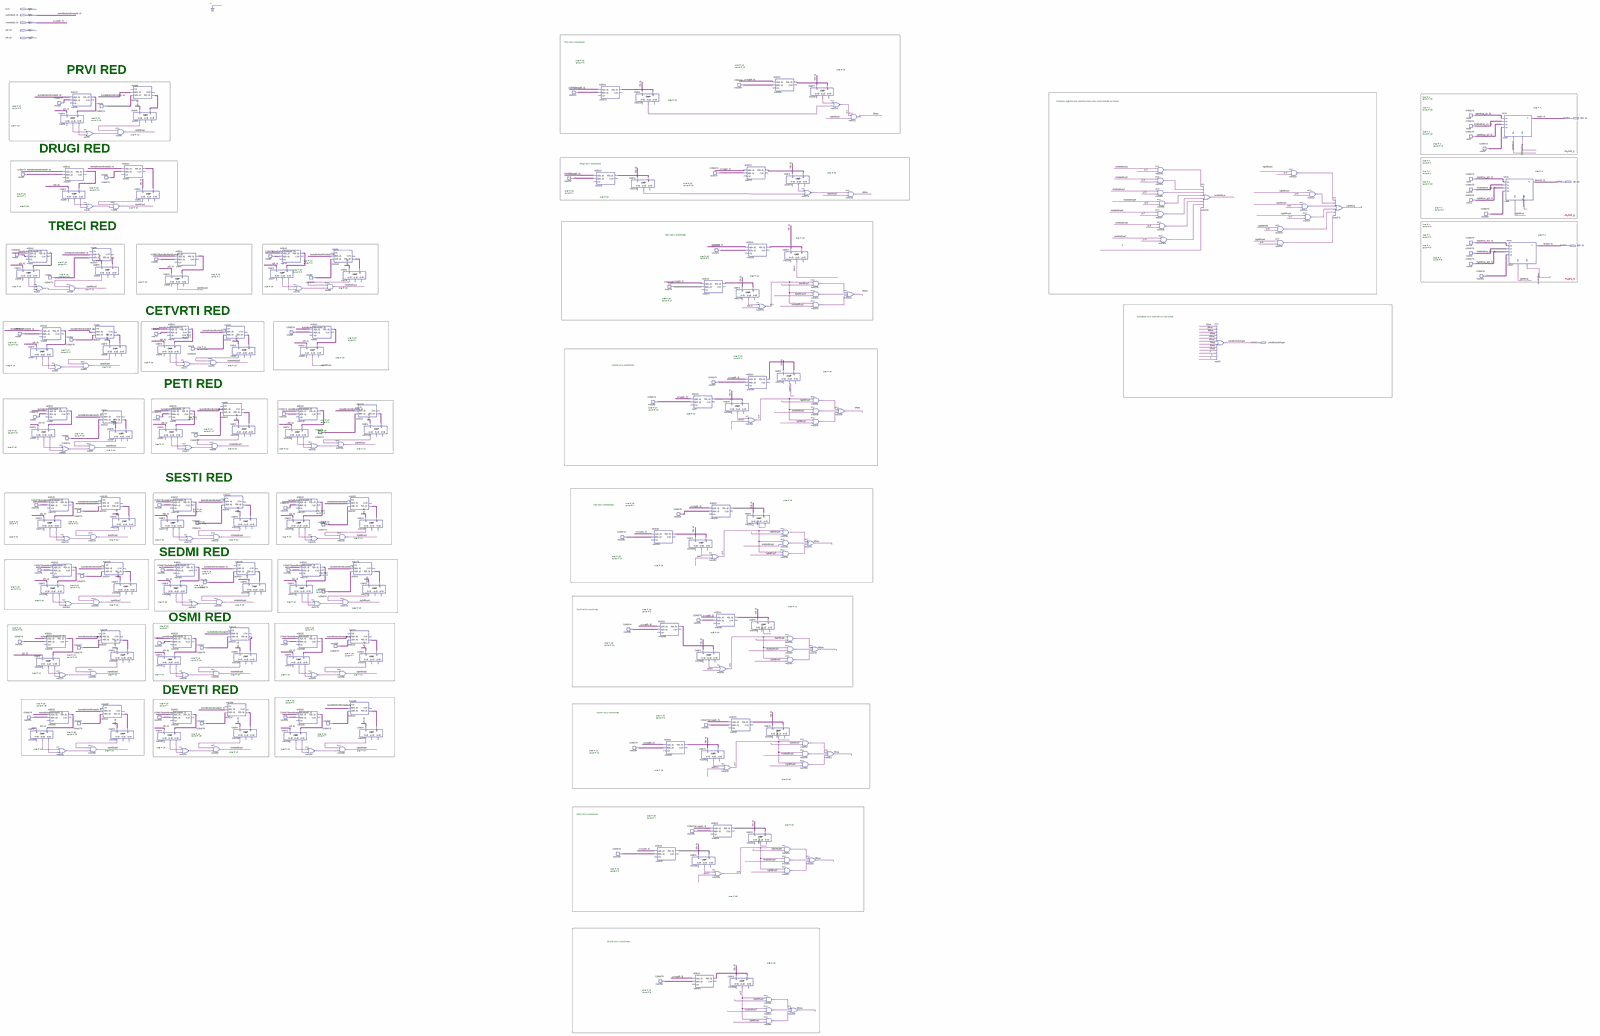
[diagram p0: schematic sheet, whole]
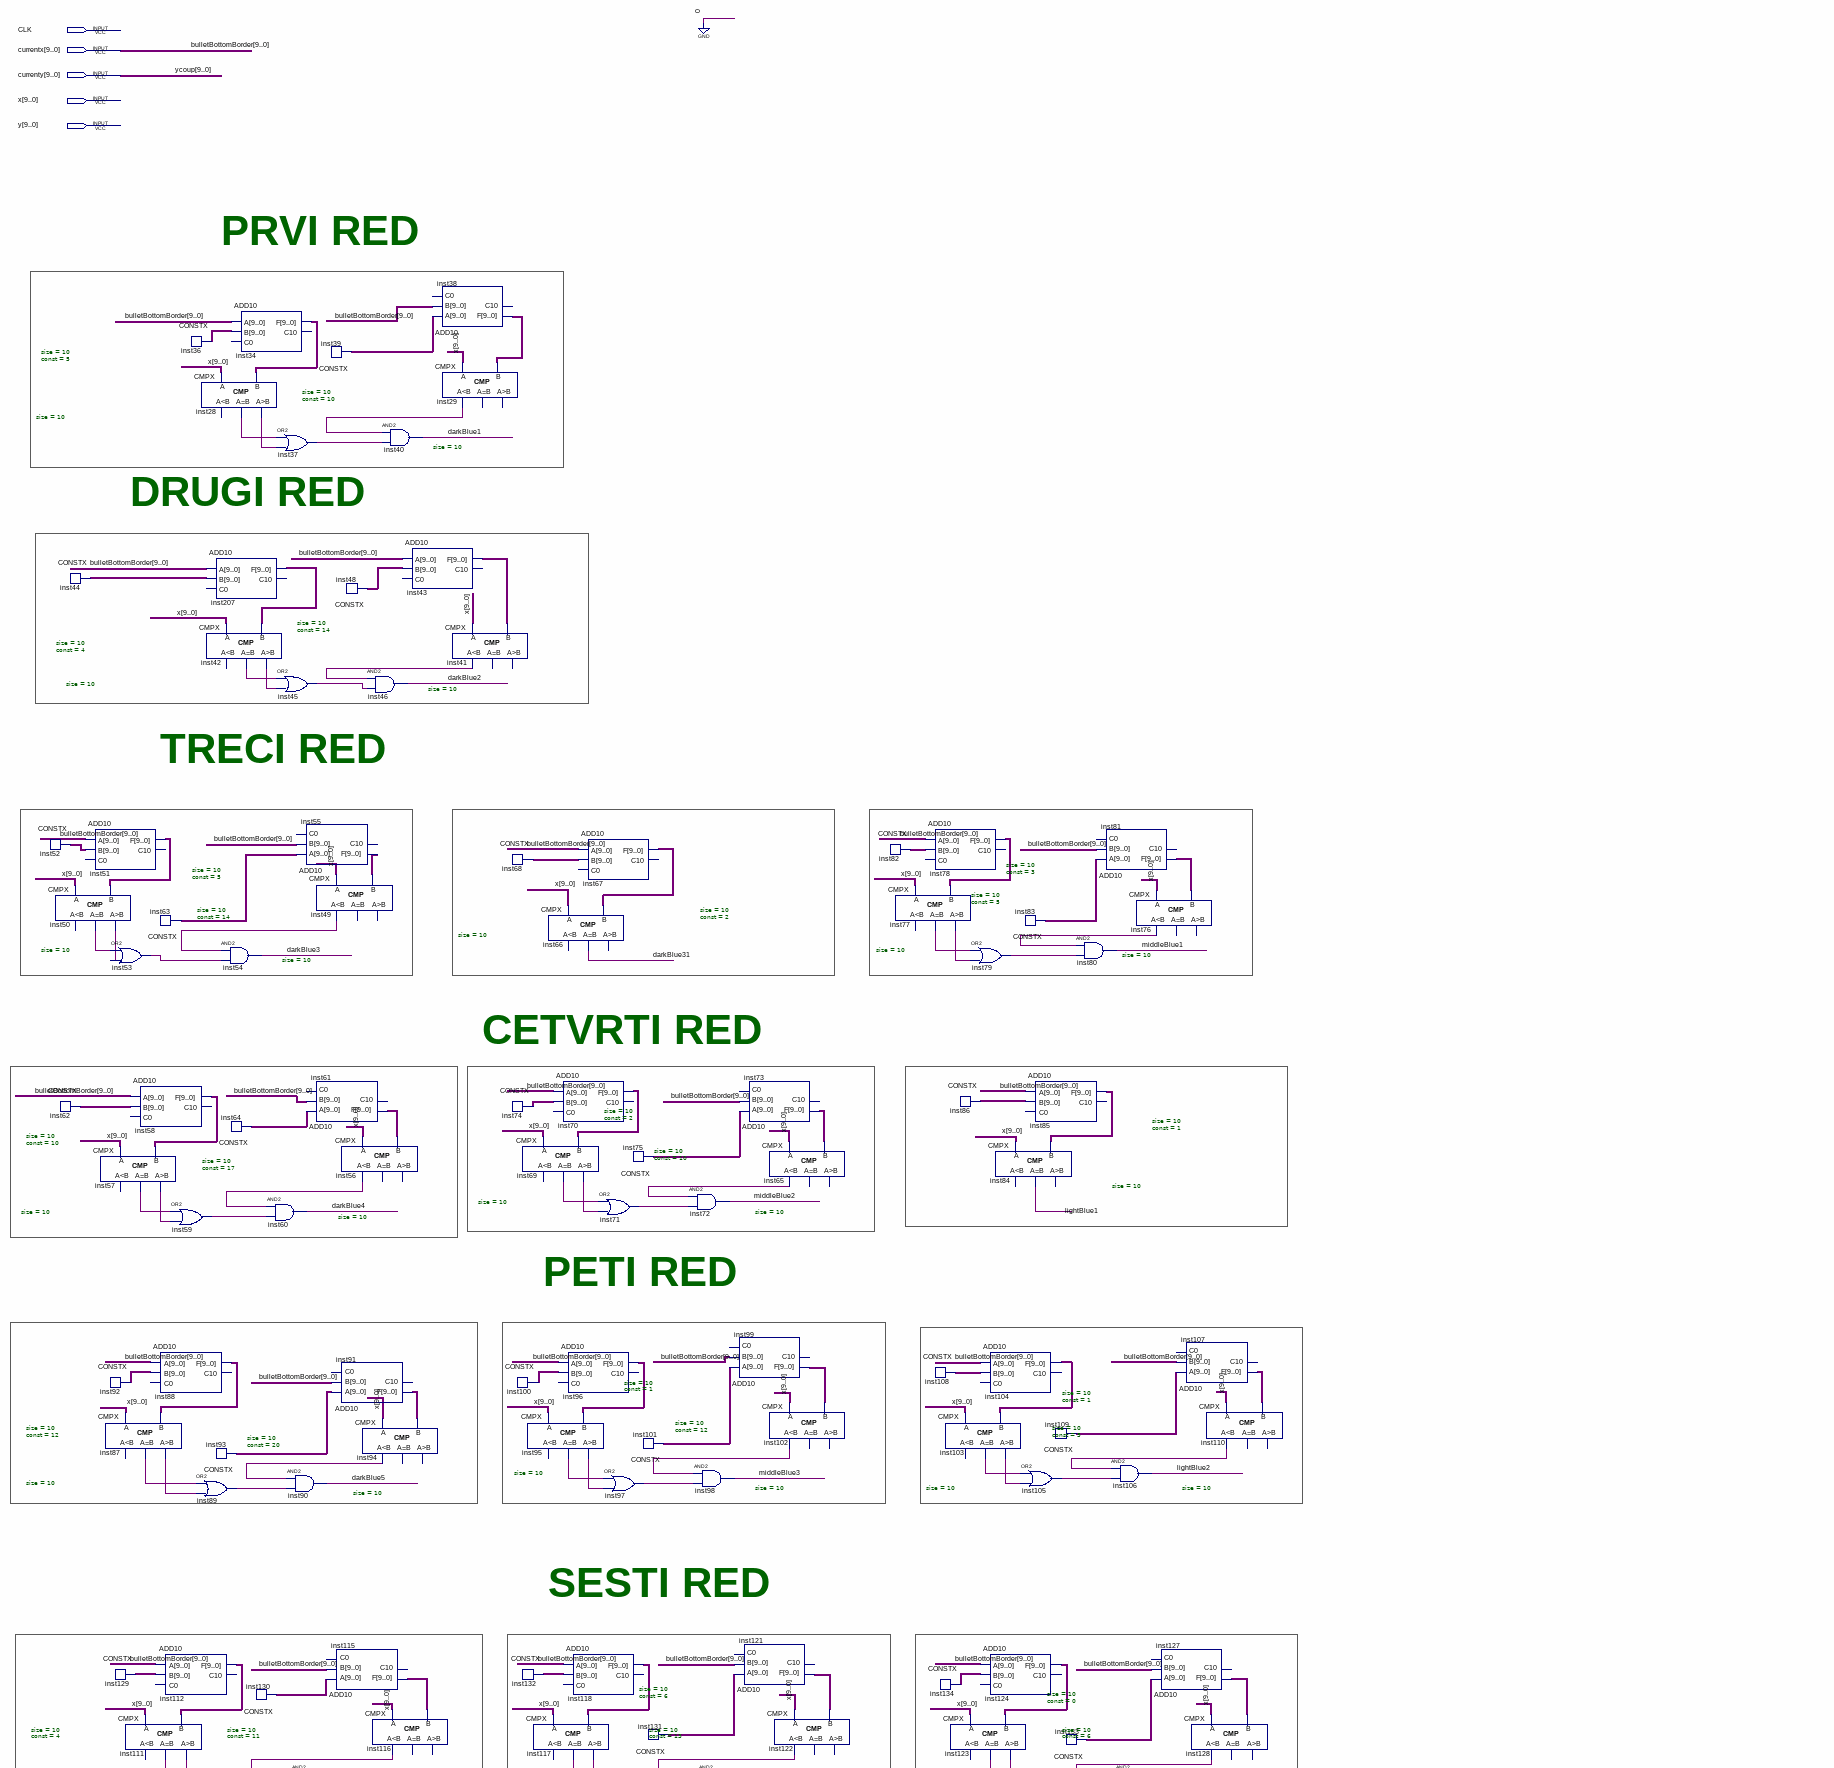
[diagram p1: schematic sheet, upper left part]
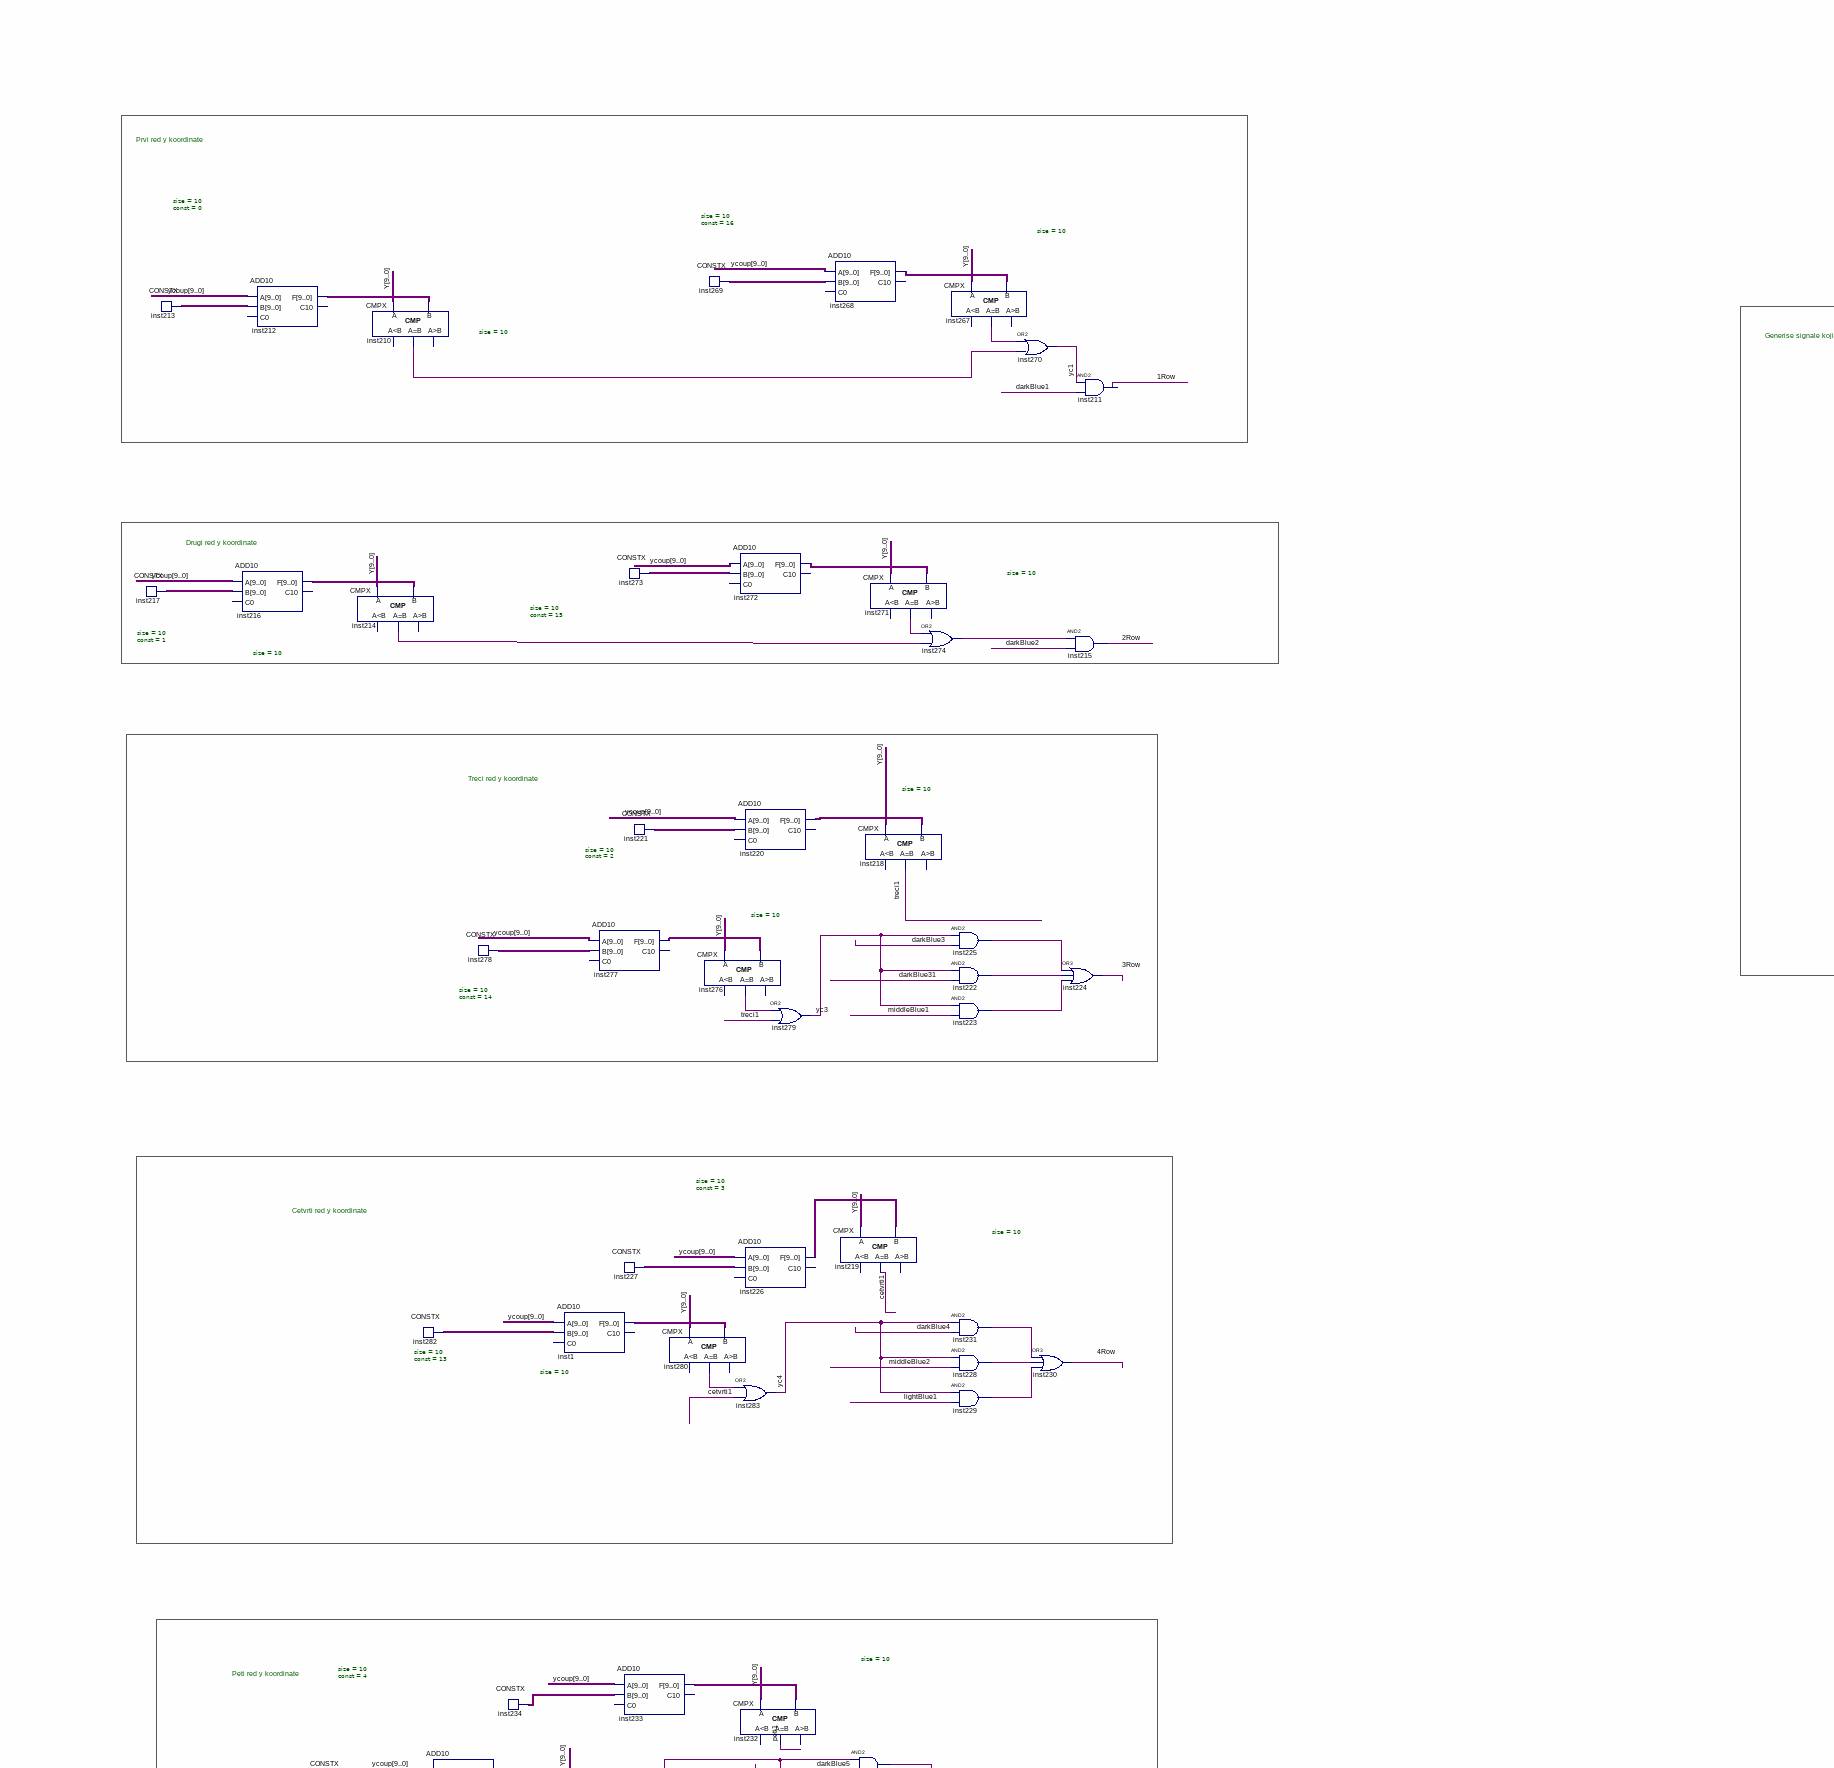
[diagram p2: schematic sheet, upper centre part]
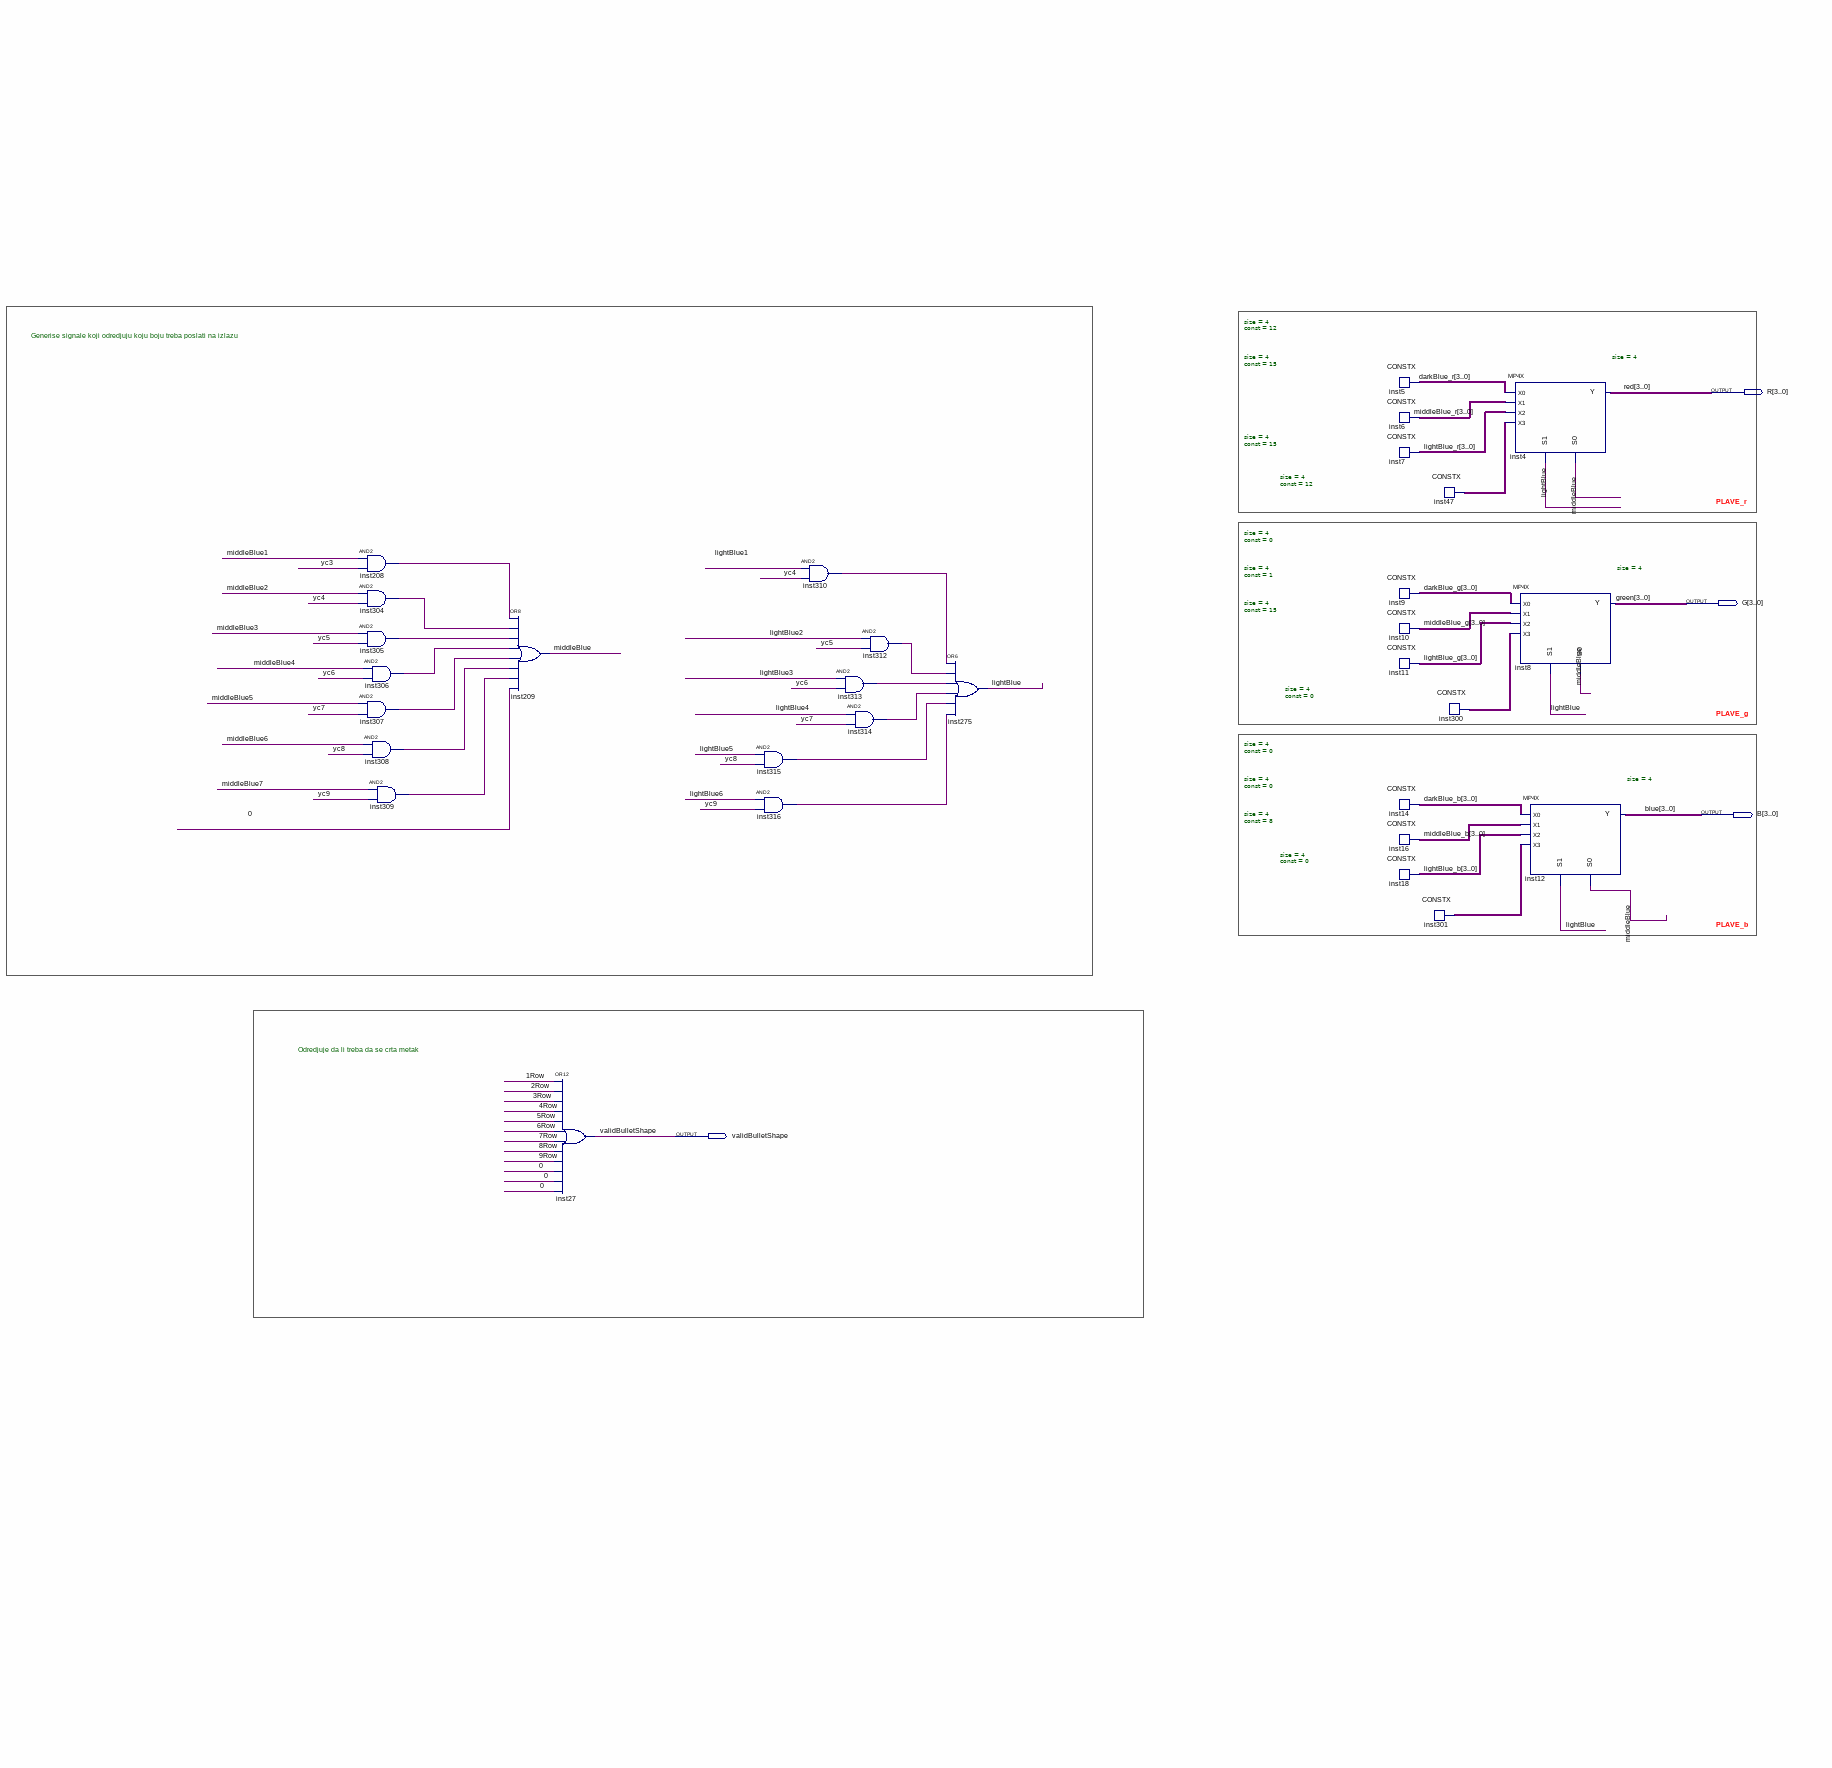
[diagram p3: schematic sheet, upper right part]
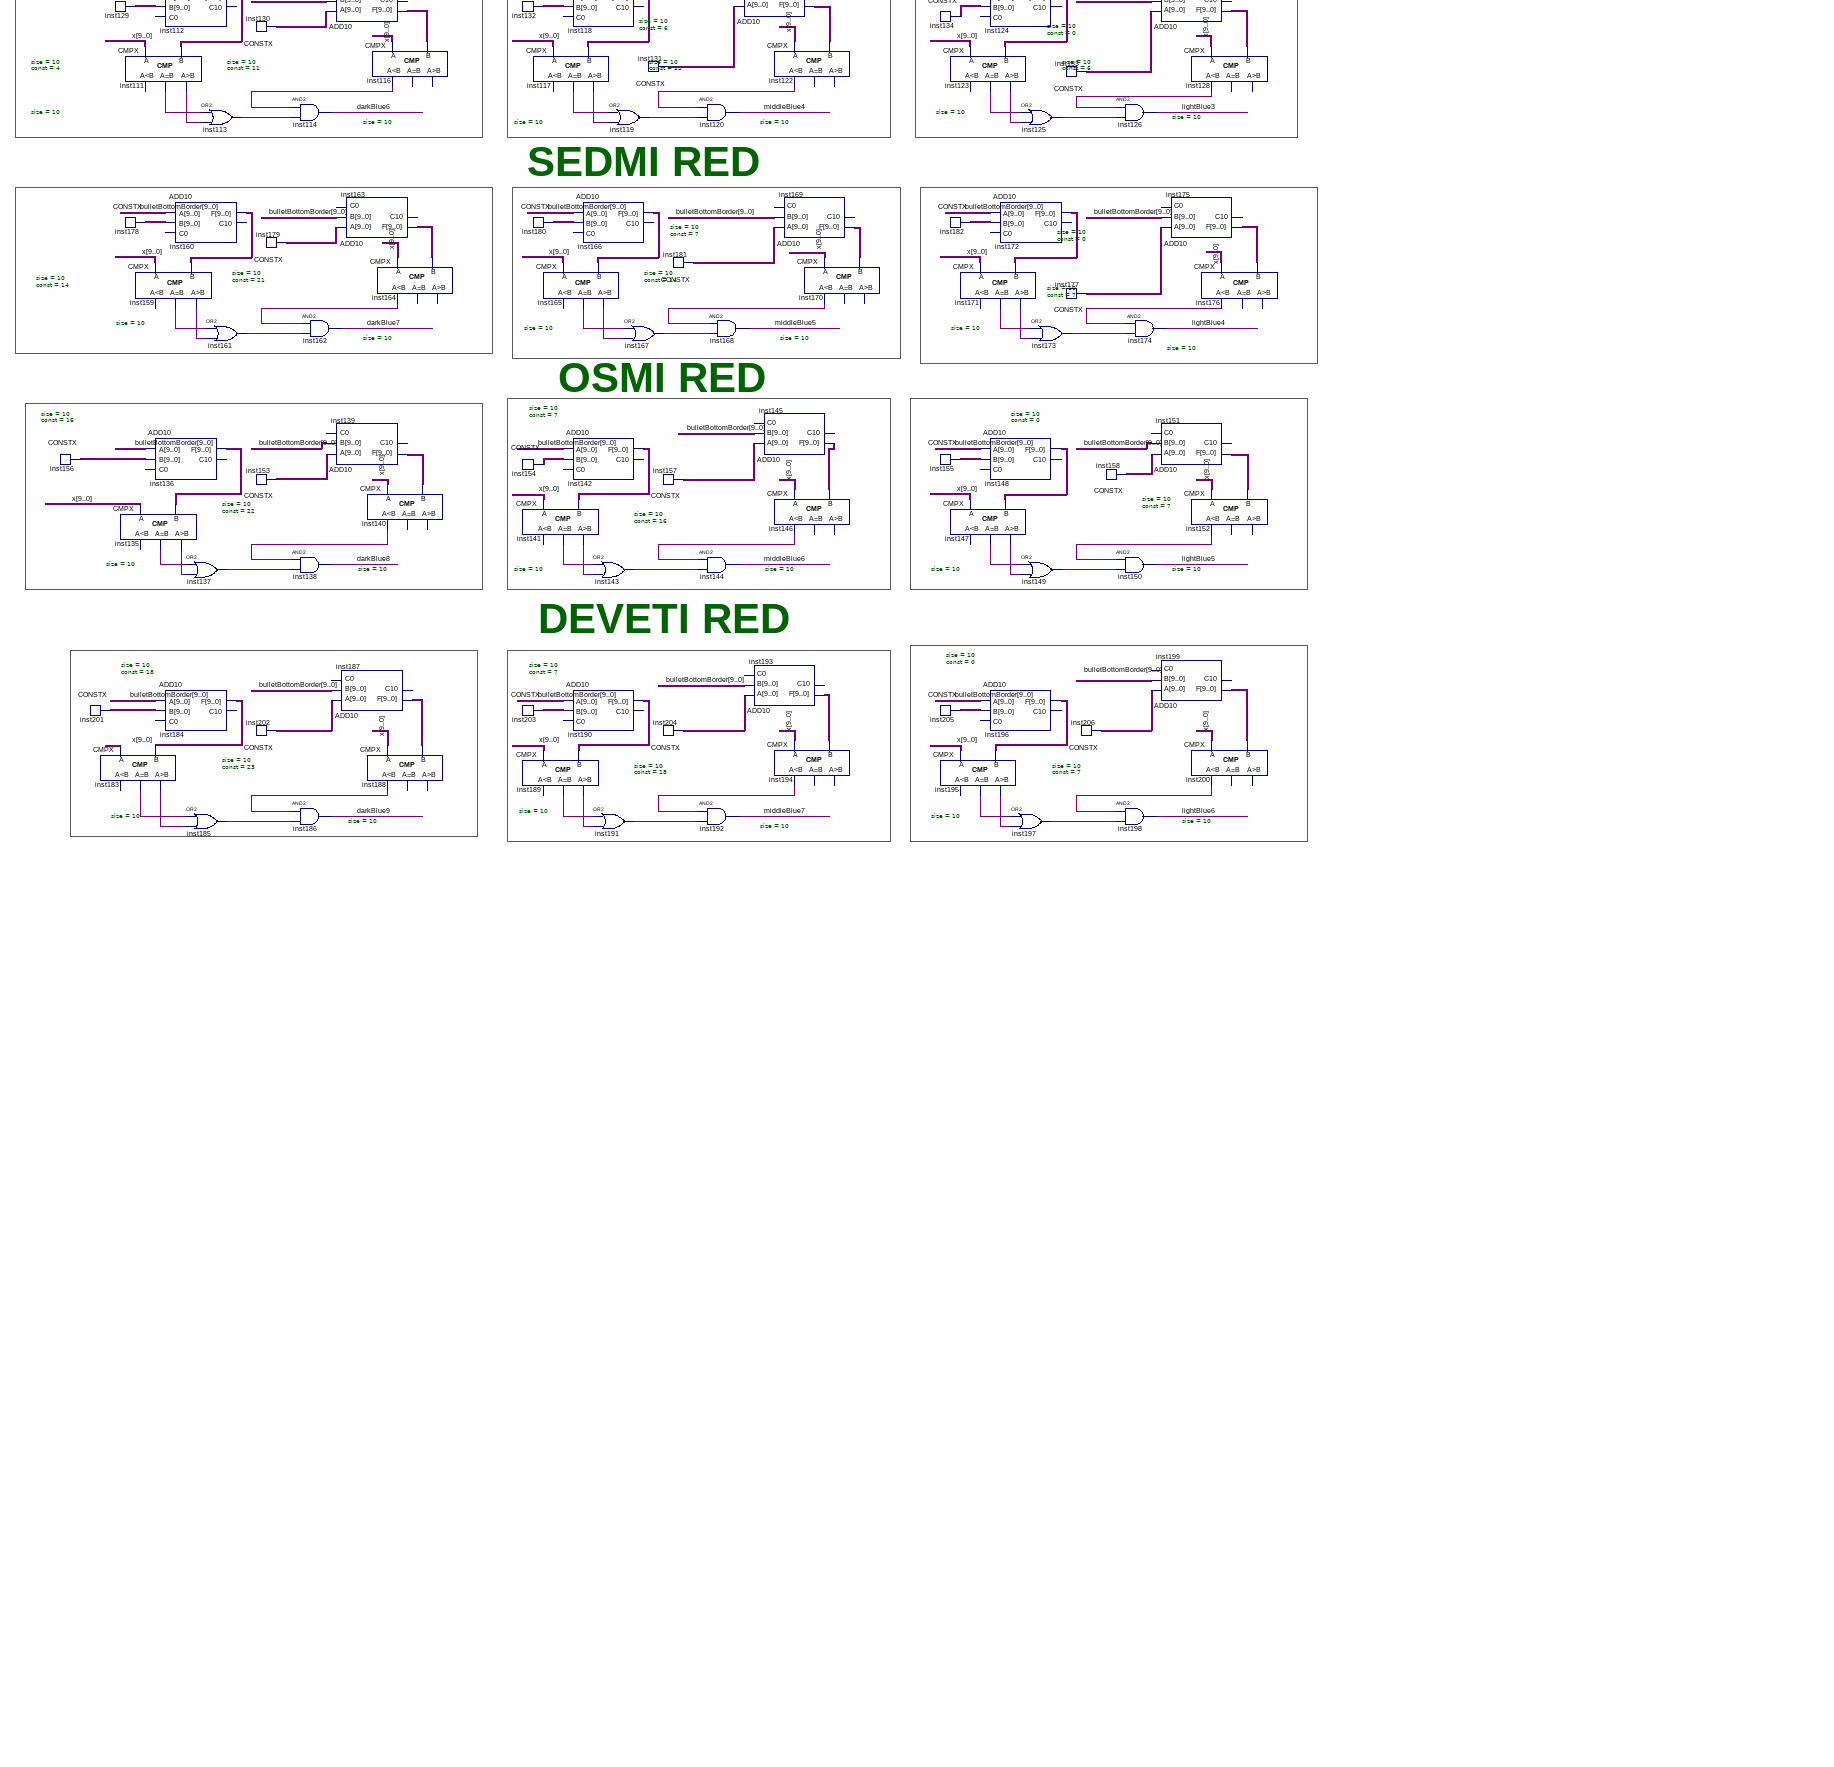
[diagram p4: schematic sheet, lower left part]
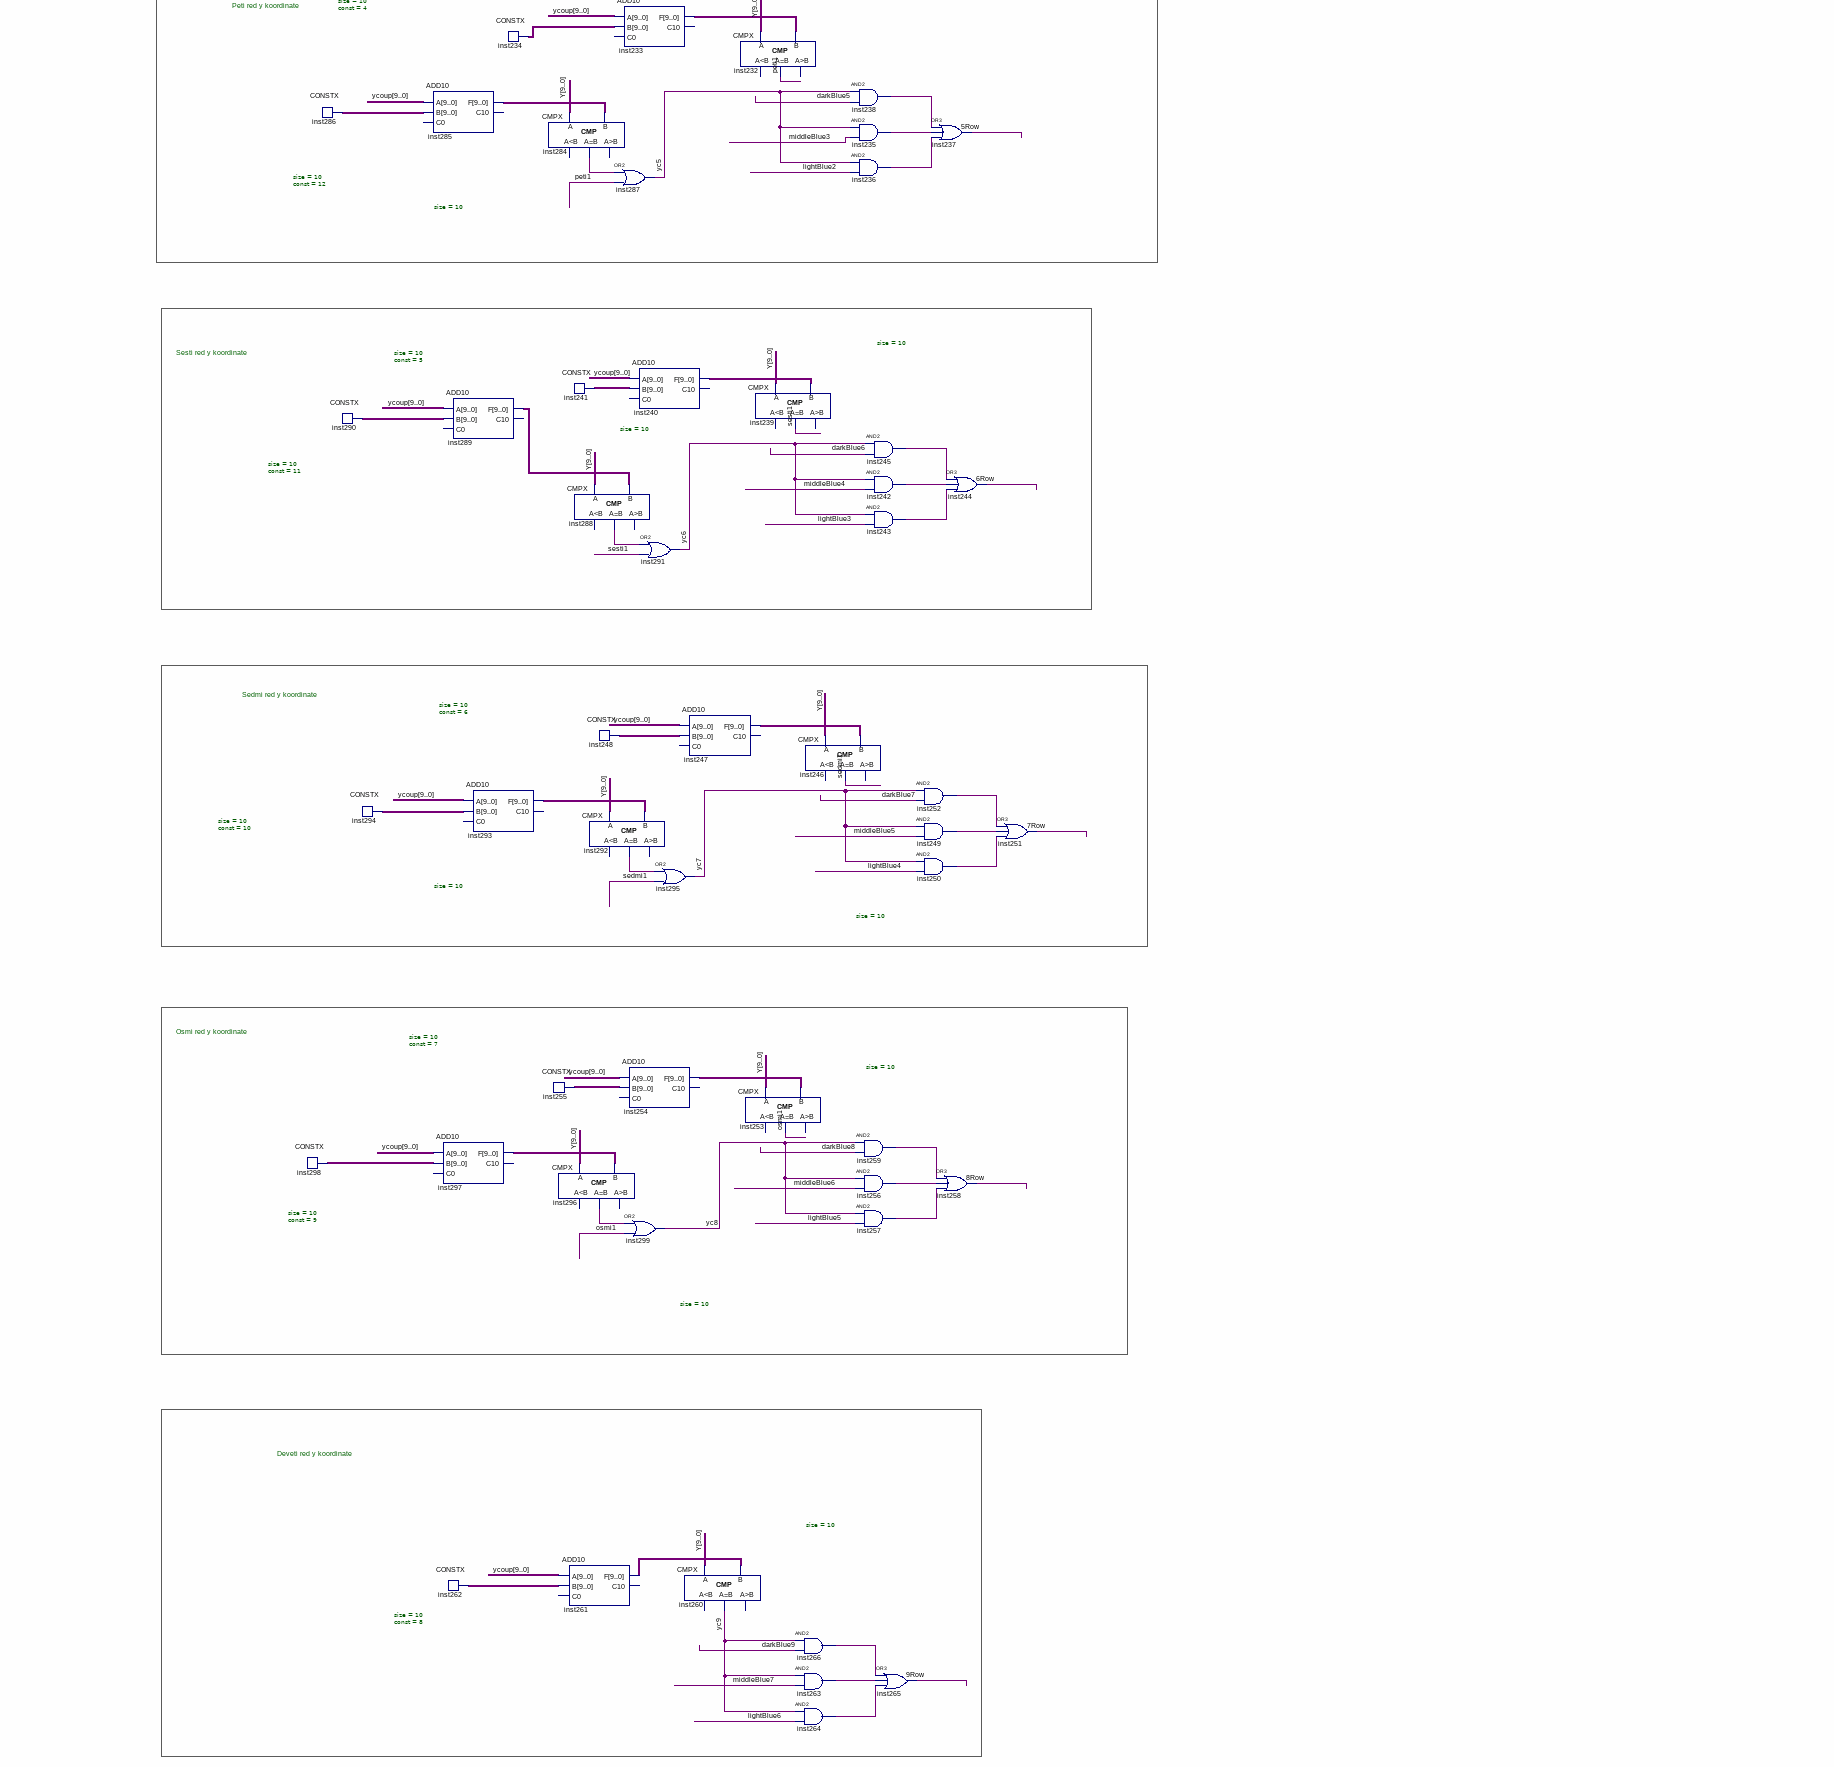
[diagram p5: schematic sheet, lower centre part]
// Quartus schematic BulletShapeBadBoy.bdf as structural Verilog: 294 symbols, 9 pins
module BulletShapeBadBoy (
  input  CLK,
  input  [9:0] currentx,
  input  [9:0] currenty,
  input  [9:0] x,
  input  [9:0] y,
  output [3:0] R,
  output [3:0] G,
  output [3:0] B,
  output validBulletShape
);

  wire \1Row , \2Row , \3Row , \4Row , \5Row , \6Row , \7Row , \8Row , \9Row , cetvrti1, darkBlue1,
       darkBlue2, darkBlue3, darkBlue4, darkBlue5, darkBlue6, darkBlue7, darkBlue8, darkBlue9, darkBlue31,
       inst28_eq, inst28_gr, inst29_ls, inst37_out, inst41_ls, inst42_eq, inst42_gr, inst45_out, inst49_ls,
       inst50_eq, inst50_gr, inst53_out, inst56_ls, inst57_eq, inst57_gr, inst59_out, inst65_ls, inst69_eq,
       inst69_gr, inst71_out, inst76_ls, inst77_eq, inst77_gr, inst79_out, inst87_eq, inst87_gr, inst89_out,
       inst94_ls, inst95_eq, inst95_gr, inst97_out, inst102_ls, inst103_eq, inst103_gr, inst105_out,
       inst110_ls, inst111_eq, inst111_gr, inst113_out, inst116_ls, inst117_eq, inst117_gr, inst119_out,
       inst122_ls, inst123_eq, inst123_gr, inst125_out, inst128_ls, inst135_eq, inst135_gr, inst137_out,
       inst140_ls, inst141_eq, inst141_gr, inst143_out, inst146_ls, inst147_eq, inst147_gr, inst149_out,
       inst152_ls, inst159_eq, inst159_gr, inst161_out, inst164_ls, inst165_eq, inst165_gr, inst167_out,
       inst170_ls, inst171_eq, inst171_gr, inst173_out, inst176_ls, inst183_eq, inst183_gr, inst185_out,
       inst188_ls, inst189_eq, inst189_gr, inst191_out, inst194_ls, inst195_eq, inst195_gr, inst197_out,
       inst200_ls, inst208_out, inst210_eq, inst214_eq, inst222_out, inst223_out, inst225_out, inst228_out,
       inst229_out, inst231_out, inst235_out, inst236_out, inst238_out, inst242_out, inst243_out,
       inst245_out, inst249_out, inst250_out, inst252_out, inst256_out, inst257_out, inst259_out,
       inst263_out, inst264_out, inst266_out, inst267_eq, inst271_eq, inst274_out, inst276_eq, inst280_eq,
       inst284_eq, inst288_eq, inst292_eq, inst296_eq, inst304_out, inst305_out, inst306_out, inst307_out,
       inst308_out, inst309_out, inst310_out, inst312_out, inst313_out, inst314_out, inst315_out,
       inst316_out, lightBlue, lightBlue1, lightBlue2, lightBlue3, lightBlue4, lightBlue5, lightBlue6,
       middleBlue, middleBlue1, middleBlue2, middleBlue3, middleBlue4, middleBlue5, middleBlue6, middleBlue7,
       osmi1, peti1, sedmi1, sesti1, treci1, yc1, yc3, yc4, yc5, yc6, yc7, yc8, yc9;
  wire [3:0] darkBlue_b, darkBlue_g, darkBlue_r, inst47_data, inst300_data, inst301_data, lightBlue_b,
       lightBlue_g, lightBlue_r, middleBlue_b, middleBlue_g, middleBlue_r;
  wire [9:0] inst1_f, inst34_f, inst36_data, inst38_f, inst39_data, inst43_f, inst44_data, inst48_data,
       inst51_f, inst52_data, inst55_f, inst58_f, inst61_f, inst62_data, inst63_data, inst64_data, inst67_f,
       inst68_data, inst70_f, inst73_f, inst74_data, inst75_data, inst78_f, inst81_f, inst82_data,
       inst83_data, inst85_f, inst86_data, inst88_f, inst91_f, inst92_data, inst93_data, inst96_f, inst99_f,
       inst100_data, inst101_data, inst104_f, inst107_f, inst108_data, inst109_data, inst112_f, inst115_f,
       inst118_f, inst121_f, inst124_f, inst127_f, inst129_data, inst130_data, inst131_data, inst132_data,
       inst133_data, inst134_data, inst136_f, inst139_f, inst142_f, inst145_f, inst148_f, inst151_f,
       inst153_data, inst154_data, inst155_data, inst156_data, inst157_data, inst158_data, inst160_f,
       inst163_f, inst166_f, inst169_f, inst172_f, inst175_f, inst177_data, inst178_data, inst179_data,
       inst180_data, inst181_data, inst182_data, inst184_f, inst187_f, inst190_f, inst193_f, inst196_f,
       inst199_f, inst201_data, inst202_data, inst203_data, inst204_data, inst205_data, inst206_data,
       inst207_f, inst212_f, inst213_data, inst216_f, inst217_data, inst220_f, inst221_data, inst226_f,
       inst227_data, inst233_f, inst234_data, inst240_f, inst241_data, inst247_f, inst248_data, inst254_f,
       inst255_data, inst261_f, inst262_data, inst268_f, inst269_data, inst272_f, inst273_data, inst277_f,
       inst278_data, inst282_data, inst285_f, inst286_data, inst289_f, inst290_data, inst293_f, inst294_data,
       inst297_f, inst298_data;

  CONSTX #(.size(10), .\const (4)) inst44 (.data(inst44_data));
  CONSTX #(.size(10), .\const (5)) inst52 (.data(inst52_data));
  CMPX #(.size(10)) inst50 (.A(x), .B(inst51_f), .eq(inst50_eq), .gr(inst50_gr));  // open: ls
  CONSTX #(.size(10), .\const (10)) inst62 (.data(inst62_data));
  CONSTX #(.size(10), .\const (16)) inst156 (.data(inst156_data));
  ADD10 inst51 (.A(currentx), .B(inst52_data), .F(inst51_f));  // open: C0, C10
  CMPX #(.size(10)) inst57 (.A(x), .B(inst58_f), .eq(inst57_eq), .gr(inst57_gr));  // open: ls
  CONSTX #(.size(10), .\const (12)) inst92 (.data(inst92_data));
  CMPX #(.size(10)) inst87 (.A(x), .B(inst88_f), .eq(inst87_eq), .gr(inst87_gr));  // open: ls
  CONSTX #(.size(10), .\const (4)) inst129 (.data(inst129_data));
  CONSTX #(.size(10), .\const (18)) inst201 (.data(inst201_data));
  CMPX #(.size(10)) inst183 (.A(x), .B(inst184_f), .eq(inst183_eq), .gr(inst183_gr));  // open: ls
  CONSTX #(.size(10), .\const (14)) inst63 (.data(inst63_data));
  or inst53 (inst53_out, inst50_eq, inst50_gr);
  ADD10 inst58 (.A(currentx), .B(inst62_data), .F(inst58_f));  // open: C0, C10
  CMPX #(.size(10)) inst111 (.A(x), .B(inst112_f), .eq(inst111_eq), .gr(inst111_gr));  // open: ls
  CONSTX #(.size(10), .\const (14)) inst178 (.data(inst178_data));
  CMPX #(.size(10)) inst159 (.A(x), .B(inst160_f), .eq(inst159_eq), .gr(inst159_gr));  // open: ls
  ADD10 inst136 (.A(currentx), .B(inst156_data), .F(inst136_f));  // open: C0, C10
  CMPX #(.size(10)) inst135 (.A(x), .B(inst136_f), .eq(inst135_eq), .gr(inst135_gr));  // open: ls
  CONSTX #(.size(10), .\const (5)) inst36 (.data(inst36_data));
  or inst59 (inst59_out, inst57_eq, inst57_gr);
  ADD10 inst88 (.A(currentx), .B(inst92_data), .F(inst88_f));  // open: C0, C10
  ADD10 inst112 (.A(currentx), .B(inst129_data), .F(inst112_f));  // open: C0, C10
  ADD10 inst160 (.A(currentx), .B(inst178_data), .F(inst160_f));  // open: C0, C10
  or inst137 (inst137_out, inst135_eq, inst135_gr);
  ADD10 inst184 (.A(currentx), .B(inst201_data), .F(inst184_f));  // open: C0, C10
  or inst185 (inst185_out, inst183_eq, inst183_gr);
  CMPX #(.size(10)) inst28 (.A(x), .B(inst34_f), .eq(inst28_eq), .gr(inst28_gr));  // open: ls
  ADD10 inst207 (.A(currentx), .B(inst44_data), .F(inst207_f));  // open: C0, C10
  CMPX #(.size(10)) inst42 (.A(x), .B(inst207_f), .eq(inst42_eq), .gr(inst42_gr));  // open: ls
  and inst54 (darkBlue3, inst49_ls, inst53_out);
  CONSTX #(.size(10), .\const (17)) inst64 (.data(inst64_data));
  CONSTX #(.size(10), .\const (20)) inst93 (.data(inst93_data));
  or inst89 (inst89_out, inst87_eq, inst87_gr);
  or inst113 (inst113_out, inst111_eq, inst111_gr);
  or inst161 (inst161_out, inst159_eq, inst159_gr);
  ADD10 inst34 (.A(currentx), .B(inst36_data), .F(inst34_f));  // open: C0, C10
  and inst60 (darkBlue4, inst56_ls, inst59_out);
  CONSTX #(.size(10), .\const (11)) inst130 (.data(inst130_data));
  CONSTX #(.size(10), .\const (21)) inst179 (.data(inst179_data));
  CONSTX #(.size(10), .\const (22)) inst153 (.data(inst153_data));
  CONSTX #(.size(10), .\const (23)) inst202 (.data(inst202_data));
  or inst37 (inst37_out, inst28_eq, inst28_gr);
  or inst45 (inst45_out, inst42_eq, inst42_gr);
  ADD10 inst55 (.A(inst63_data), .B(currentx), .F(inst55_f));  // open: C0, C10
  CMPX #(.size(10)) inst49 (.A(x), .B(inst55_f), .ls(inst49_ls));  // open: eq, gr
  ADD10 inst61 (.A(inst64_data), .B(currentx), .F(inst61_f));  // open: C0, C10
  and inst90 (darkBlue5, inst94_ls, inst89_out);
  and inst114 (darkBlue6, inst116_ls, inst113_out);
  and inst162 (darkBlue7, inst164_ls, inst161_out);
  and inst138 (darkBlue8, inst140_ls, inst137_out);
  and inst186 (darkBlue9, inst188_ls, inst185_out);
  CONSTX #(.size(10), .\const (10)) inst39 (.data(inst39_data));
  CONSTX #(.size(10), .\const (14)) inst48 (.data(inst48_data));
  CMPX #(.size(10)) inst56 (.A(x), .B(inst61_f), .ls(inst56_ls));  // open: eq, gr
  ADD10 inst91 (.A(inst93_data), .B(currentx), .F(inst91_f));  // open: C0, C10
  ADD10 inst115 (.A(inst130_data), .B(currentx), .F(inst115_f));  // open: C0, C10
  ADD10 inst163 (.A(inst179_data), .B(currentx), .F(inst163_f));  // open: C0, C10
  ADD10 inst139 (.A(inst153_data), .B(currentx), .F(inst139_f));  // open: C0, C10
  ADD10 inst187 (.A(inst202_data), .B(currentx), .F(inst187_f));  // open: C0, C10
  and inst40 (darkBlue1, inst29_ls, inst37_out);
  and inst46 (darkBlue2, inst41_ls, inst45_out);
  CMPX #(.size(10)) inst94 (.A(x), .B(inst91_f), .ls(inst94_ls));  // open: eq, gr
  CMPX #(.size(10)) inst116 (.A(x), .B(inst115_f), .ls(inst116_ls));  // open: eq, gr
  CMPX #(.size(10)) inst164 (.A(x), .B(inst163_f), .ls(inst164_ls));  // open: eq, gr
  CMPX #(.size(10)) inst140 (.A(x), .B(inst139_f), .ls(inst140_ls));  // open: eq, gr
  CMPX #(.size(10)) inst188 (.A(x), .B(inst187_f), .ls(inst188_ls));  // open: eq, gr
  ADD10 inst43 (.A(currentx), .B(inst48_data), .F(inst43_f));  // open: C0, C10
  ADD10 inst38 (.A(inst39_data), .B(currentx), .F(inst38_f));  // open: C0, C10
  CMPX #(.size(10)) inst29 (.A(x), .B(inst38_f), .ls(inst29_ls));  // open: eq, gr
  CMPX #(.size(10)) inst41 (.A(x), .B(inst43_f), .ls(inst41_ls));  // open: eq, gr
  CONSTX #(.size(10), .\const (2)) inst68 (.data(inst68_data));
  CONSTX #(.size(10), .\const (2)) inst74 (.data(inst74_data));
  CONSTX #(.size(10), .\const (1)) inst100 (.data(inst100_data));
  CONSTX #(.size(10), .\const (6)) inst132 (.data(inst132_data));
  CONSTX #(.size(10), .\const (7)) inst154 (.data(inst154_data));
  CONSTX #(.size(10), .\const (7)) inst203 (.data(inst203_data));
  CMPX #(.size(10)) inst66 (.A(x), .B(inst67_f), .eq(darkBlue31));  // open: ls, gr
  CMPX #(.size(10)) inst69 (.A(x), .B(inst70_f), .eq(inst69_eq), .gr(inst69_gr));  // open: ls
  CMPX #(.size(10)) inst95 (.A(x), .B(inst96_f), .eq(inst95_eq), .gr(inst95_gr));  // open: ls
  CMPX #(.size(10)) inst117 (.A(x), .B(inst118_f), .eq(inst117_eq), .gr(inst117_gr));  // open: ls
  CONSTX #(.size(10), .\const (7)) inst180 (.data(inst180_data));
  CMPX #(.size(10)) inst165 (.A(x), .B(inst166_f), .eq(inst165_eq), .gr(inst165_gr));  // open: ls
  CMPX #(.size(10)) inst141 (.A(x), .B(inst142_f), .eq(inst141_eq), .gr(inst141_gr));  // open: ls
  CMPX #(.size(10)) inst189 (.A(x), .B(inst190_f), .eq(inst189_eq), .gr(inst189_gr));  // open: ls
  ADD10 inst67 (.A(currentx), .B(inst68_data), .F(inst67_f));  // open: C0, C10
  ADD10 inst70 (.A(currentx), .B(inst74_data), .F(inst70_f));  // open: C0, C10
  ADD10 inst96 (.A(currentx), .B(inst100_data), .F(inst96_f));  // open: C0, C10
  ADD10 inst118 (.A(currentx), .B(inst132_data), .F(inst118_f));  // open: C0, C10
  ADD10 inst166 (.A(currentx), .B(inst180_data), .F(inst166_f));  // open: C0, C10
  ADD10 inst142 (.A(currentx), .B(inst154_data), .F(inst142_f));  // open: C0, C10
  ADD10 inst190 (.A(currentx), .B(inst203_data), .F(inst190_f));  // open: C0, C10
  CONSTX #(.size(10), .\const (10)) inst75 (.data(inst75_data));
  or inst71 (inst71_out, inst69_eq, inst69_gr);
  CONSTX #(.size(10), .\const (12)) inst101 (.data(inst101_data));
  or inst97 (inst97_out, inst95_eq, inst95_gr);
  or inst119 (inst119_out, inst117_eq, inst117_gr);
  or inst167 (inst167_out, inst165_eq, inst165_gr);
  or inst143 (inst143_out, inst141_eq, inst141_gr);
  or inst191 (inst191_out, inst189_eq, inst189_gr);
  CONSTX #(.size(10), .\const (13)) inst131 (.data(inst131_data));
  CONSTX #(.size(10), .\const (14)) inst181 (.data(inst181_data));
  CONSTX #(.size(10), .\const (16)) inst157 (.data(inst157_data));
  CONSTX #(.size(10), .\const (18)) inst204 (.data(inst204_data));
  and inst72 (middleBlue2, inst65_ls, inst71_out);
  and inst98 (middleBlue3, inst102_ls, inst97_out);
  and inst120 (middleBlue4, inst122_ls, inst119_out);
  and inst168 (middleBlue5, inst170_ls, inst167_out);
  and inst144 (middleBlue6, inst146_ls, inst143_out);
  and inst192 (middleBlue7, inst194_ls, inst191_out);
  ADD10 inst73 (.A(inst75_data), .B(currentx), .F(inst73_f));  // open: C0, C10
  ADD10 inst99 (.A(inst101_data), .B(currentx), .F(inst99_f));  // open: C0, C10
  ADD10 inst121 (.A(inst131_data), .B(currentx), .F(inst121_f));  // open: C0, C10
  ADD10 inst193 (.A(inst204_data), .B(currentx), .F(inst193_f));  // open: C0, C10
  CMPX #(.size(10)) inst65 (.A(x), .B(inst73_f), .ls(inst65_ls));  // open: eq, gr
  CMPX #(.size(10)) inst102 (.A(x), .B(inst99_f), .ls(inst102_ls));  // open: eq, gr
  CMPX #(.size(10)) inst122 (.A(x), .B(inst121_f), .ls(inst122_ls));  // open: eq, gr
  ADD10 inst169 (.A(inst181_data), .B(currentx), .F(inst169_f));  // open: C0, C10
  ADD10 inst145 (.A(inst157_data), .B(currentx), .F(inst145_f));  // open: C0, C10
  CMPX #(.size(10)) inst146 (.A(x), .B(inst145_f), .ls(inst146_ls));  // open: eq, gr
  CMPX #(.size(10)) inst194 (.A(x), .B(inst193_f), .ls(inst194_ls));  // open: eq, gr
  CMPX #(.size(10)) inst170 (.A(x), .B(inst169_f), .ls(inst170_ls));  // open: eq, gr
  CONSTX #(.size(10), .\const (3)) inst82 (.data(inst82_data));
  CMPX #(.size(10)) inst77 (.A(x), .B(inst78_f), .eq(inst77_eq), .gr(inst77_gr));  // open: ls
  ADD10 inst78 (.A(currentx), .B(inst82_data), .F(inst78_f));  // open: C0, C10
  CONSTX #(.size(10), .\const (1)) inst86 (.data(inst86_data));
  CONSTX #(.size(10), .\const (1)) inst108 (.data(inst108_data));
  CMPX #(.size(10)) inst103 (.A(x), .B(inst104_f), .eq(inst103_eq), .gr(inst103_gr));  // open: ls
  CONSTX #(.size(10), .\const (0)) inst134 (.data(inst134_data));
  CMPX #(.size(10)) inst123 (.A(x), .B(inst124_f), .eq(inst123_eq), .gr(inst123_gr));  // open: ls
  CONSTX #(.size(10), .\const (0)) inst182 (.data(inst182_data));
  CMPX #(.size(10)) inst171 (.A(x), .B(inst172_f), .eq(inst171_eq), .gr(inst171_gr));  // open: ls
  CONSTX #(.size(10), .\const (0)) inst155 (.data(inst155_data));
  CMPX #(.size(10)) inst147 (.A(x), .B(inst148_f), .eq(inst147_eq), .gr(inst147_gr));  // open: ls
  CONSTX #(.size(10), .\const (0)) inst205 (.data(inst205_data));
  CMPX #(.size(10)) inst195 (.A(x), .B(inst196_f), .eq(inst195_eq), .gr(inst195_gr));  // open: ls
  or inst79 (inst79_out, inst77_eq, inst77_gr);
  CMPX #(.size(10)) inst84 (.A(x), .B(inst85_f), .eq(lightBlue1));  // open: ls, gr
  ADD10 inst104 (.A(currentx), .B(inst108_data), .F(inst104_f));  // open: C0, C10
  ADD10 inst124 (.A(currentx), .B(inst134_data), .F(inst124_f));  // open: C0, C10
  ADD10 inst172 (.A(currentx), .B(inst182_data), .F(inst172_f));  // open: C0, C10
  ADD10 inst148 (.A(currentx), .B(inst155_data), .F(inst148_f));  // open: C0, C10
  ADD10 inst196 (.A(currentx), .B(inst205_data), .F(inst196_f));  // open: C0, C10
  CONSTX #(.size(10), .\const (5)) inst83 (.data(inst83_data));
  ADD10 inst85 (.A(currentx), .B(inst86_data), .F(inst85_f));  // open: C0, C10
  or inst105 (inst105_out, inst103_eq, inst103_gr);
  or inst125 (inst125_out, inst123_eq, inst123_gr);
  or inst173 (inst173_out, inst171_eq, inst171_gr);
  or inst149 (inst149_out, inst147_eq, inst147_gr);
  or inst197 (inst197_out, inst195_eq, inst195_gr);
  CONSTX #(.size(10), .\const (5)) inst109 (.data(inst109_data));
  CONSTX #(.size(10), .\const (6)) inst133 (.data(inst133_data));
  CONSTX #(.size(10), .\const (7)) inst177 (.data(inst177_data));
  CONSTX #(.size(10), .\const (7)) inst206 (.data(inst206_data));
  ADD10 inst81 (.A(inst83_data), .B(currentx), .F(inst81_f));  // open: C0, C10
  and inst80 (middleBlue1, inst76_ls, inst79_out);
  and inst106 (lightBlue2, inst110_ls, inst105_out);
  CONSTX #(.size(10), .\const (7)) inst158 (.data(inst158_data));
  CMPX #(.size(10)) inst76 (.A(x), .B(inst81_f), .ls(inst76_ls));  // open: eq, gr
  ADD10 inst127 (.A(inst133_data), .B(currentx), .F(inst127_f));  // open: C0, C10
  and inst126 (lightBlue3, inst128_ls, inst125_out);
  and inst174 (lightBlue4, inst176_ls, inst173_out);
  ADD10 inst151 (.A(inst158_data), .B(currentx), .F(inst151_f));  // open: C0, C10
  and inst150 (lightBlue5, inst152_ls, inst149_out);
  ADD10 inst199 (.A(inst206_data), .B(currentx), .F(inst199_f));  // open: C0, C10
  and inst198 (lightBlue6, inst200_ls, inst197_out);
  ADD10 inst107 (.A(inst109_data), .B(currentx), .F(inst107_f));  // open: C0, C10
  CMPX #(.size(10)) inst128 (.A(x), .B(inst127_f), .ls(inst128_ls));  // open: eq, gr
  ADD10 inst175 (.A(inst177_data), .B(currentx), .F(inst175_f));  // open: C0, C10
  CMPX #(.size(10)) inst176 (.A(x), .B(inst175_f), .ls(inst176_ls));  // open: eq, gr
  CMPX #(.size(10)) inst152 (.A(x), .B(inst151_f), .ls(inst152_ls));  // open: eq, gr
  CMPX #(.size(10)) inst200 (.A(x), .B(inst199_f), .ls(inst200_ls));  // open: eq, gr
  CMPX #(.size(10)) inst110 (.A(x), .B(inst107_f), .ls(inst110_ls));  // open: eq, gr
  CONSTX #(.size(10), .\const (1)) inst217 (.data(inst217_data));
  CONSTX #(.size(10), .\const (0)) inst213 (.data(inst213_data));
  ADD10 inst212 (.A(currenty), .B(inst213_data), .F(inst212_f));  // open: C0, C10
  ADD10 inst216 (.A(currenty), .B(inst217_data), .F(inst216_f));  // open: C0, C10
  CONSTX #(.size(10), .\const (9)) inst298 (.data(inst298_data));
  CONSTX #(.size(10), .\const (12)) inst286 (.data(inst286_data));
  CONSTX #(.size(10), .\const (11)) inst290 (.data(inst290_data));
  CMPX #(.size(10)) inst210 (.A(y), .B(inst212_f), .eq(inst210_eq));  // open: ls, gr
  CMPX #(.size(10)) inst214 (.A(y), .B(inst216_f), .eq(inst214_eq));  // open: ls, gr
  CONSTX #(.size(10), .\const (10)) inst294 (.data(inst294_data));
  CONSTX #(.size(10), .\const (13)) inst282 (.data(inst282_data));
  ADD10 inst285 (.A(currenty), .B(inst286_data), .F(inst285_f));  // open: C0, C10
  CONSTX #(.size(10), .\const (14)) inst278 (.data(inst278_data));
  ADD10 inst289 (.A(currenty), .B(inst290_data), .F(inst289_f));  // open: C0, C10
  ADD10 inst293 (.A(currenty), .B(inst294_data), .F(inst293_f));  // open: C0, C10
  ADD10 inst297 (.A(currenty), .B(inst298_data), .F(inst297_f));  // open: C0, C10
  CONSTX #(.size(10), .\const (8)) inst262 (.data(inst262_data));
  CONSTX #(.size(10), .\const (4)) inst234 (.data(inst234_data));
  CMPX #(.size(10)) inst284 (.A(y), .B(inst285_f), .eq(inst284_eq));  // open: ls, gr
  CONSTX #(.size(10), .\const (7)) inst255 (.data(inst255_data));
  ADD10 inst1 (.A(currenty), .B(inst282_data), .F(inst1_f));  // open: C0, C10
  CONSTX #(.size(10), .\const (5)) inst241 (.data(inst241_data));
  CMPX #(.size(10)) inst288 (.A(y), .B(inst289_f), .eq(inst288_eq));  // open: ls, gr
  CONSTX #(.size(10), .\const (6)) inst248 (.data(inst248_data));
  CMPX #(.size(10)) inst292 (.A(y), .B(inst293_f), .eq(inst292_eq));  // open: ls, gr
  CMPX #(.size(10)) inst296 (.A(y), .B(inst297_f), .eq(inst296_eq));  // open: ls, gr
  ADD10 inst261 (.A(currenty), .B(inst262_data), .F(inst261_f));  // open: C0, C10
  CONSTX #(.size(10), .\const (15)) inst273 (.data(inst273_data));
  CONSTX #(.size(10), .\const (2)) inst221 (.data(inst221_data));
  ADD10 inst277 (.A(currenty), .B(inst278_data), .F(inst277_f));  // open: C0, C10
  CONSTX #(.size(10), .\const (3)) inst227 (.data(inst227_data));
  ADD10 inst233 (.A(currenty), .B(inst234_data), .F(inst233_f));  // open: C0, C10
  or inst287 (yc5, inst284_eq, peti1);
  ADD10 inst254 (.A(currenty), .B(inst255_data), .F(inst254_f));  // open: C0, C10
  or inst299 (yc8, inst296_eq, osmi1);
  CMPX #(.size(10)) inst280 (.A(y), .B(inst1_f), .eq(inst280_eq));  // open: ls, gr
  ADD10 inst240 (.A(currenty), .B(inst241_data), .F(inst240_f));  // open: C0, C10
  or inst291 (yc6, inst288_eq, sesti1);
  or inst295 (yc7, inst292_eq, sedmi1);
  CONSTX #(.size(10), .\const (16)) inst269 (.data(inst269_data));
  CMPX #(.size(10)) inst276 (.A(y), .B(inst277_f), .eq(inst276_eq));  // open: ls, gr
  ADD10 inst247 (.A(currenty), .B(inst248_data), .F(inst247_f));  // open: C0, C10
  CMPX #(.size(10)) inst260 (.A(y), .B(inst261_f), .eq(yc9));  // open: ls, gr
  ADD10 inst272 (.A(currenty), .B(inst273_data), .F(inst272_f));  // open: C0, C10
  ADD10 inst220 (.A(currenty), .B(inst221_data), .F(inst220_f));  // open: C0, C10
  ADD10 inst226 (.A(currenty), .B(inst227_data), .F(inst226_f));  // open: C0, C10
  or inst283 (yc4, inst280_eq, cetvrti1);
  CMPX #(.size(10)) inst232 (.A(y), .B(inst233_f), .eq(peti1));  // open: ls, gr
  CMPX #(.size(10)) inst239 (.A(y), .B(inst240_f), .eq(sesti1));  // open: ls, gr
  CMPX #(.size(10)) inst253 (.A(y), .B(inst254_f), .eq(osmi1));  // open: ls, gr
  or inst279 (yc3, inst276_eq, treci1);
  ADD10 inst268 (.A(currenty), .B(inst269_data), .F(inst268_f));  // open: C0, C10
  CMPX #(.size(10)) inst246 (.A(y), .B(inst247_f), .eq(sedmi1));  // open: ls, gr
  and inst266 (inst266_out, yc9, darkBlue9);
  and inst263 (inst263_out, yc9, middleBlue7);
  and inst264 (inst264_out, yc9, lightBlue6);
  CMPX #(.size(10)) inst271 (.A(y), .B(inst272_f), .eq(inst271_eq));  // open: ls, gr
  CMPX #(.size(10)) inst218 (.A(y), .B(inst220_f), .eq(treci1));  // open: ls, gr
  CMPX #(.size(10)) inst219 (.A(y), .B(inst226_f), .eq(cetvrti1));  // open: ls, gr
  and inst238 (inst238_out, yc5, darkBlue5);
  and inst235 (inst235_out, yc5, middleBlue3);
  and inst236 (inst236_out, yc5, lightBlue2);
  and inst245 (inst245_out, yc6, darkBlue6);
  and inst242 (inst242_out, yc6, middleBlue4);
  and inst243 (inst243_out, yc6, lightBlue3);
  and inst259 (inst259_out, yc8, darkBlue8);
  and inst256 (inst256_out, yc8, middleBlue6);
  and inst257 (inst257_out, yc8, lightBlue5);
  or inst265 (\9Row , inst266_out, inst263_out, inst264_out);
  CMPX #(.size(10)) inst267 (.A(y), .B(inst268_f), .eq(inst267_eq));  // open: ls, gr
  or inst274 (inst274_out, inst271_eq, inst214_eq);
  or inst237 (\5Row , inst238_out, inst235_out, inst236_out);
  or inst244 (\6Row , inst245_out, inst242_out, inst243_out);
  and inst252 (inst252_out, yc7, darkBlue7);
  and inst249 (inst249_out, yc7, middleBlue5);
  and inst250 (inst250_out, yc7, lightBlue4);
  or inst258 (\8Row , inst259_out, inst256_out, inst257_out);
  and inst225 (inst225_out, yc3, darkBlue3);
  and inst222 (inst222_out, yc3, darkBlue31);
  and inst223 (inst223_out, yc3, middleBlue1);
  and inst231 (inst231_out, yc4, darkBlue4);
  and inst228 (inst228_out, yc4, middleBlue2);
  and inst229 (inst229_out, yc4, lightBlue1);
  or inst270 (yc1, inst267_eq, inst210_eq);
  or inst251 (\7Row , inst252_out, inst249_out, inst250_out);
  and inst215 (\2Row , inst274_out, darkBlue2);
  or inst224 (\3Row , inst225_out, inst222_out, inst223_out);
  or inst230 (\4Row , inst231_out, inst228_out, inst229_out);
  and inst211 (\1Row , yc1, darkBlue1);
  and inst208 (inst208_out, middleBlue1, yc3);
  and inst304 (inst304_out, middleBlue2, yc4);
  and inst305 (inst305_out, middleBlue3, yc5);
  and inst306 (inst306_out, middleBlue4, yc6);
  and inst307 (inst307_out, middleBlue5, yc7);
  and inst308 (inst308_out, middleBlue6, yc8);
  and inst309 (inst309_out, middleBlue7, yc9);
  or inst209 (middleBlue, inst208_out, inst304_out, inst305_out, inst306_out, inst307_out, inst308_out, inst309_out, 1'b0);
  or inst27 (validBulletShape, \1Row , \2Row , \3Row , \4Row , \5Row , \6Row , \7Row , \8Row , \9Row , 1'b0, 1'b0, 1'b0);
  and inst315 (inst315_out, lightBlue5, yc8);
  and inst316 (inst316_out, lightBlue6, yc9);
  and inst310 (inst310_out, lightBlue1, yc4);
  and inst312 (inst312_out, lightBlue2, yc5);
  and inst313 (inst313_out, lightBlue3, yc6);
  and inst314 (inst314_out, lightBlue4, yc7);
  or inst275 (lightBlue, inst310_out, inst312_out, inst313_out, inst314_out, inst315_out, inst316_out);
  CONSTX #(.size(4), .\const (12)) inst5 (.data(darkBlue_r));
  CONSTX #(.size(4), .\const (15)) inst6 (.data(middleBlue_r));
  CONSTX #(.size(4), .\const (15)) inst7 (.data(lightBlue_r));
  CONSTX #(.size(4), .\const (0)) inst9 (.data(darkBlue_g));
  CONSTX #(.size(4), .\const (1)) inst10 (.data(middleBlue_g));
  CONSTX #(.size(4), .\const (15)) inst11 (.data(lightBlue_g));
  CONSTX #(.size(4), .\const (0)) inst14 (.data(darkBlue_b));
  CONSTX #(.size(4), .\const (0)) inst16 (.data(middleBlue_b));
  CONSTX #(.size(4), .\const (8)) inst18 (.data(lightBlue_b));
  CONSTX #(.size(4), .\const (0)) inst301 (.data(inst301_data));
  CONSTX #(.size(4), .\const (12)) inst47 (.data(inst47_data));
  CONSTX #(.size(4), .\const (0)) inst300 (.data(inst300_data));
  MP4X #(.size(4)) inst4 (
    .X0(darkBlue_r), .X1(middleBlue_r), .X2(lightBlue_r), .X3(inst47_data), .S1(lightBlue), .S0(middleBlue),
    .Y(R));
  MP4X #(.size(4)) inst8 (
    .X0(darkBlue_g), .X1(middleBlue_g), .X2(lightBlue_g), .X3(inst300_data), .S1(lightBlue), .S0(middleBlue),
    .Y(G));
  MP4X #(.size(4)) inst12 (
    .X0(darkBlue_b), .X1(middleBlue_b), .X2(lightBlue_b), .X3(inst301_data), .S1(lightBlue), .S0(middleBlue),
    .Y(B));

  // Other names for the same wires on the sheet: blue[3:0] = B; bulletBottomBorder[9:0] = currentx; green[3:0] = G;
  //   red[3:0] = R; ycoup[9:0] = currenty

  // Notes on the sheet:
  //   Prvi red y koordinate
  //   PRVI RED
  //   Generise signale koji odredjuju koju boju treba poslati na izlazu                                                                                                                                                                                                                               
  //   DRUGI RED
  //   PLAVE_r
  //   Drugi red y koordinate
  //   PLAVE_g
  //   TRECI RED
  //   Treci red y koordinate
  //   PLAVE_b
  //   CETVRTI RED
  //   Odredjuje da li treba da se crta metak                                                                                                                                                                
  //   Cetvrti red y koordinate
  //   PETI RED
  //   SESTI RED
  //   Peti red y koordinate
  //   SEDMI RED
  //   Sesti red y koordinate
  //   OSMI RED
  //   DEVETI RED
  //   Sedmi red y koordinate
  //   Osmi red y koordinate
  //   Deveti red y koordinate
endmodule
